# EAGLE schematic RC_Engine_Sound_ESP32 (EAGLE 7.6.0)
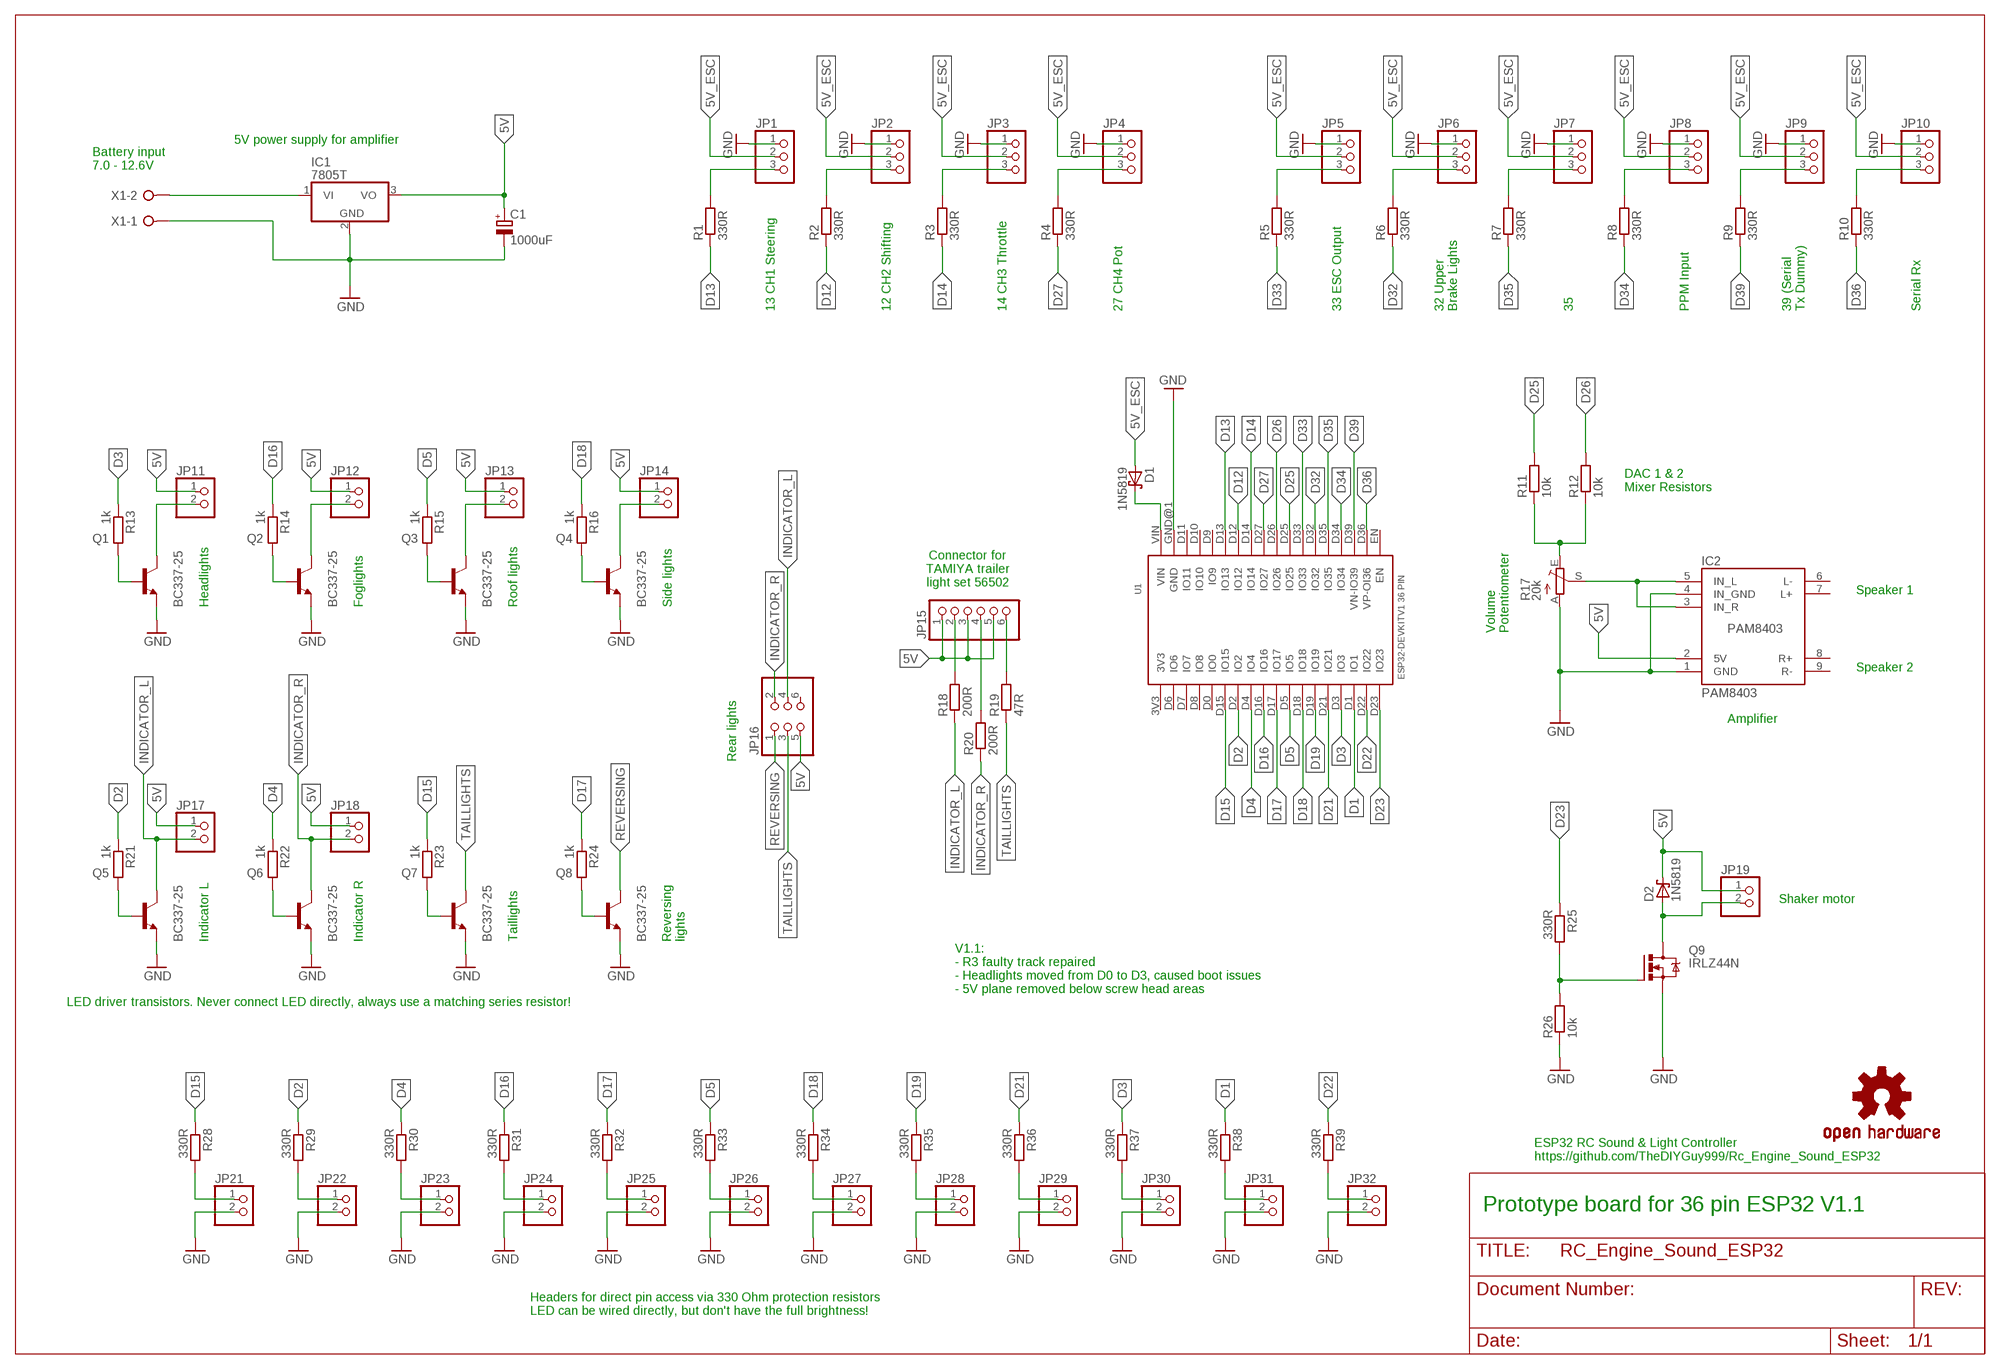
[diagram p0: schematic, sheet 1]

## Parts
C1  1000uF  CPOL-EUE5-10.5  [E5-10,5]
D1  1N5819  SCHOTTKY-DIODEDO35-7  [DO35-7]
D2  1N5819  SCHOTTKY-DIODEDO35-7  [DO35-7]
IC1  7805T  [TO220H]
IC2  PAM8403  [PAM8403]
JP1  PINHD-1X3  [1X03]
JP2  PINHD-1X3  [1X03]
JP3  PINHD-1X3  [1X03]
JP4  PINHD-1X3  [1X03]
JP5  PINHD-1X3  [1X03]
JP6  PINHD-1X3  [1X03]
JP7  PINHD-1X3  [1X03]
JP8  PINHD-1X3  [1X03]
JP9  PINHD-1X3  [1X03]
JP10  PINHD-1X3  [1X03]
JP11  PINHD-1X2  [1X02]
JP12  PINHD-1X2  [1X02]
JP13  PINHD-1X2  [1X02]
JP14  PINHD-1X2  [1X02]
JP15  PINHD-1X6  [1X06]
JP16  PINHD-2X3  [2X03]
JP17  PINHD-1X2  [1X02]
JP18  PINHD-1X2  [1X02]
JP19  PINHD-1X2  [1X02]
JP21  PINHD-1X2  [1X02]
JP22  PINHD-1X2  [1X02]
JP23  PINHD-1X2  [1X02]
JP24  PINHD-1X2  [1X02]
JP25  PINHD-1X2  [1X02]
JP26  PINHD-1X2  [1X02]
JP27  PINHD-1X2  [1X02]
JP28  PINHD-1X2  [1X02]
JP29  PINHD-1X2  [1X02]
JP30  PINHD-1X2  [1X02]
JP31  PINHD-1X2  [1X02]
JP32  PINHD-1X2  [1X02]
LOGO1  OSHW-LOGOM  [OSHW-LOGO-M]
Q1  BC337-25  [TO92]
Q2  BC337-25  [TO92]
Q3  BC337-25  [TO92]
Q4  BC337-25  [TO92]
Q5  BC337-25  [TO92]
Q6  BC337-25  [TO92]
Q7  BC337-25  [TO92]
Q8  BC337-25  [TO92]
Q9  IRLZ44N  IRF540  [TO220BV]
R1  330R  R-EU_0207/2V  [0207/2V]
R2  330R  R-EU_0207/2V  [0207/2V]
R3  330R  R-EU_0207/2V  [0207/2V]
R4  330R  R-EU_0207/2V  [0207/2V]
R5  330R  R-EU_0207/2V  [0207/2V]
R6  330R  R-EU_0207/2V  [0207/2V]
R7  330R  R-EU_0207/2V  [0207/2V]
R8  330R  R-EU_0207/2V  [0207/2V]
R9  330R  R-EU_0207/2V  [0207/2V]
R10  330R  R-EU_0207/2V  [0207/2V]
R11  10k  R-EU_0207/10  [0207/10]
R12  10k  R-EU_0207/10  [0207/10]
R13  1k  R-EU_0207/2V  [0207/2V]
R14  1k  R-EU_0207/2V  [0207/2V]
R15  1k  R-EU_0207/2V  [0207/2V]
R16  1k  R-EU_0207/2V  [0207/2V]
R17  20k  TRIM_EU-S64W  [S64W]
R18  200R  R-EU_0207/2V  [0207/2V]
R19  47R  R-EU_0207/2V  [0207/2V]
R20  200R  R-EU_0207/2V  [0207/2V]
R21  1k  R-EU_0207/2V  [0207/2V]
R22  1k  R-EU_0207/2V  [0207/2V]
R23  1k  R-EU_0207/2V  [0207/2V]
R24  1k  R-EU_0207/2V  [0207/2V]
R25  330R  R-EU_0207/2V  [0207/2V]
R26  10k  R-EU_0207/2V  [0207/2V]
R28  330R  R-EU_0207/2V  [0207/2V]
R29  330R  R-EU_0207/2V  [0207/2V]
R30  330R  R-EU_0207/2V  [0207/2V]
R31  330R  R-EU_0207/2V  [0207/2V]
R32  330R  R-EU_0207/2V  [0207/2V]
R33  330R  R-EU_0207/2V  [0207/2V]
R34  330R  R-EU_0207/2V  [0207/2V]
R35  330R  R-EU_0207/2V  [0207/2V]
R36  330R  R-EU_0207/2V  [0207/2V]
R37  330R  R-EU_0207/2V  [0207/2V]
R38  330R  R-EU_0207/2V  [0207/2V]
R39  330R  R-EU_0207/2V  [0207/2V]
U1  ESP32DEVKITV1  [ESP32-DEVKITV1]
X1  W237-02P  [W237-132]

## Nets
5V: C1.+ D2.C IC1.3(VO) IC2.2(5V) JP11.1 JP12.1 JP13.1 JP14.1 JP15.1 JP15.3 JP15.5 JP16.5 JP17.1 JP18.1 JP19.1
5V_ESC: D1.A JP1.2 JP2.2 JP3.2 JP4.2 JP5.2 JP6.2 JP7.2 JP8.2 JP9.2 JP10.2
BAT+: IC1.1(VI) X1.2
D1: R38.1 U1.D1(IO1)
D2: R21.1 R29.1 U1.D2(IO2)
D3: R13.1 R37.1 U1.D3(IO3)
D4: R22.1 R30.1 U1.D4(IO4)
D5: R15.1 R33.1 U1.D5(IO5)
D12: R2.1 U1.D12(IO12)
D13: R1.1 U1.D13(IO13)
D14: R3.1 U1.D14(IO14)
D15: R23.1 R28.1 U1.D15(IO15)
D16: R14.1 R31.1 U1.D16(IO16)
D17: R24.1 R32.1 U1.D17(IO17)
D18: R16.1 R34.1 U1.D18(IO18)
D19: R35.1 U1.D19(IO19)
D21: R36.1 U1.D21(IO21)
D22: R39.1 U1.D22(IO22)
D23: R25.1 U1.D23(IO23)
D25: R11.2 U1.D25(IO25)
D26: R12.2 U1.D26(IO26)
D27: R4.1 U1.D27(IO27)
D32: R6.1 U1.D32(IO32)
D33: R5.1 U1.D33(IO33)
D34: R8.1 U1.D34(IO34)
D35: R7.1 U1.D35(IO35)
D36: R10.1 U1.D36(VP-OI36)
D39: R9.1 U1.D39(VN-IO39)
GND: C1.- IC1.2(GND) IC2.1(GND) IC2.4(IN_GND) JP1.1 JP2.1 JP3.1 JP4.1 JP5.1 JP6.1 JP7.1 JP8.1 JP9.1 JP10.1 JP21.2 JP22.2 JP23.2 JP24.2 JP25.2 JP26.2 JP27.2 JP28.2 JP29.2 JP30.2 JP31.2 JP32.2 Q1.1(E) Q2.1(E) Q3.1(E) Q4.1(E) Q5.1(E) Q6.1(E) Q7.1(E) Q8.1(E) Q9.S R17.A R26.1 U1.GND@1(GND) X1.1
INDICATOR_L: JP16.4 JP17.2 Q5.3(C) R18.1
INDICATOR_R: JP16.2 JP18.2 Q6.3(C) R20.1
N$1: IC2.3(IN_R) IC2.5(IN_L) R17.S
N$2: R11.1 R12.1 R17.E
N$3: JP1.3 R1.2
N$4: Q9.G R25.2 R26.2
N$5: JP2.3 R2.2
N$6: JP3.3 R3.2
N$7: JP4.3 R4.2
N$8: JP5.3 R5.2
N$9: D1.C U1.VIN
N$10: JP6.3 R6.2
N$11: JP7.3 R7.2
N$12: JP8.3 R8.2
N$13: JP9.3 R9.2
N$14: JP10.3 R10.2
N$15: D2.A JP19.2 Q9.D
N$16: Q1.2(B) R13.2
N$17: Q2.2(B) R14.2
N$18: JP11.2 Q1.3(C)
N$19: JP12.2 Q2.3(C)
N$20: Q7.2(B) R23.2
N$21: JP15.2 R18.2
N$22: Q5.2(B) R21.2
N$23: JP15.4 R20.2
N$24: Q6.2(B) R22.2
N$25: JP15.6 R19.2
N$26: Q8.2(B) R24.2
N$27: Q3.2(B) R15.2
N$28: JP13.2 Q3.3(C)
N$29: Q4.2(B) R16.2
N$30: JP14.2 Q4.3(C)
N$32: JP21.1 R28.2
N$33: JP22.1 R29.2
N$34: JP23.1 R30.2
N$35: JP24.1 R31.2
N$36: JP25.1 R32.2
N$37: JP26.1 R33.2
N$38: JP27.1 R34.2
N$39: JP28.1 R35.2
N$40: JP29.1 R36.2
N$41: JP30.1 R37.2
N$42: JP31.1 R38.2
N$43: JP32.1 R39.2
REVERSING: JP16.1 Q8.3(C)
TAILLIGHTS: JP16.3 Q7.3(C) R19.1
Unconnected: IC2.6(L-) IC2.7(L+) IC2.8(R+) IC2.9(R-) JP16.6 U1.3V3 U1.D0(IO0) U1.D6(IO6) U1.D7(IO7) U1.D8(IO8) U1.D9(IO9) U1.D10(IO10) U1.D11(IO11) U1.EN

## Notes on the sheet
- 5V power supply for amplifier
- Battery input
  7.0 - 12.6V
- 13 CH1 Steering | 12 CH2 Shifting | 14 CH3 Throttle | 27 CH4 Pot | 33 ESC Output
- 32 Upper
  Brake Lights
- 35 | PPM Input
- 39 (Serial
  Tx Dummy)
- Serial Rx
- DAC 1 & 2
  Mixer Resistors
- Connector for
  TAMIYA trailer
  light set 56502
- Speaker 1
- Headlights | Foglights | Roof lights | Side lights
- Volume
  Potentiometer
- Speaker 2
- Amplifier
- Rear lights
- Shaker motor
- Indicator L | Indicator R | Taillights
- Reversing
  lights
- V1.1:
  - R3 faulty track repaired
  - Headlights moved from D0 to D3, caused boot issues
  - 5V plane removed below screw head areas
- LED driver transistors. Never connect LED directly, always use a matching series resistor!
- ESP32 RC Sound & Light Controller
  https://github.com/TheDIYGuy999/Rc_Engine_Sound_ESP32
- Prototype board for 36 pin ESP32 V1.1
- Headers for direct pin access via 330 Ohm protection resistors
  LED can be wired directly, but don't have the full brightness!

## Library data of the parts
C1 = rcl:CPOL-EU: POLARIZED CAPACITOR, European symbol
D1 D2 = diode:SCHOTTKY-DIODE: Schottky Diode
IC1 = linear:78*: Positive VOLTAGE REGULATOR Source: http://cache.national.com/ds/LM/LM78L05.pdf http://www.fairchildsemi.com/ds/LM/LM7805.pdf
IC2 = 00_custom:PAM8403: 2Channel 3W DC 2.5-5V Class D Amplifier Board
JP1-JP10 = 00_custom_pinhead:PINHD-1X3: PIN HEADER
JP11-JP14 JP17-JP19 JP21-JP32 = 00_custom_pinhead:PINHD-1X2: PIN HEADER
JP15 = 00_custom_pinhead:PINHD-1X6: PIN HEADER
JP16 = 00_custom_pinhead:PINHD-2X3: PIN HEADER
LOGO1 = SparkFun-Aesthetics:OSHW-LOGO: Open Source Hardware Logo This logo indicates the piece of hardware it is found on incorporates a OSHW license and/or adheres to the definition of open source hardware found here: http://freedomdefined.org/OSHW
Q1-Q8 = transistor-npn:BC337*: NPN Transistor
Q9 = transistor-power:IRF540: HEXFET Power MOSFET
R1-R16 R18-R26 R28-R39 = rcl:R-EU_: RESISTOR, European symbol
R17 = pot:TRIM_EU-: POTENTIOMETER
U1 = ESP32-DEVKITV1_36pin:ESP32DEVKITV1
X1 = con-wago-508:W237-02P: WAGO SREW CLAMP; OC_FARNELL: unknown; OC_NEWARK: unknown

## Net classes
0 5V: clearance 0.254 mm